# EAGLE design 119_03_INTELLIGENT_SENSOR_BOARD_816 (EAGLE 9.6.2)
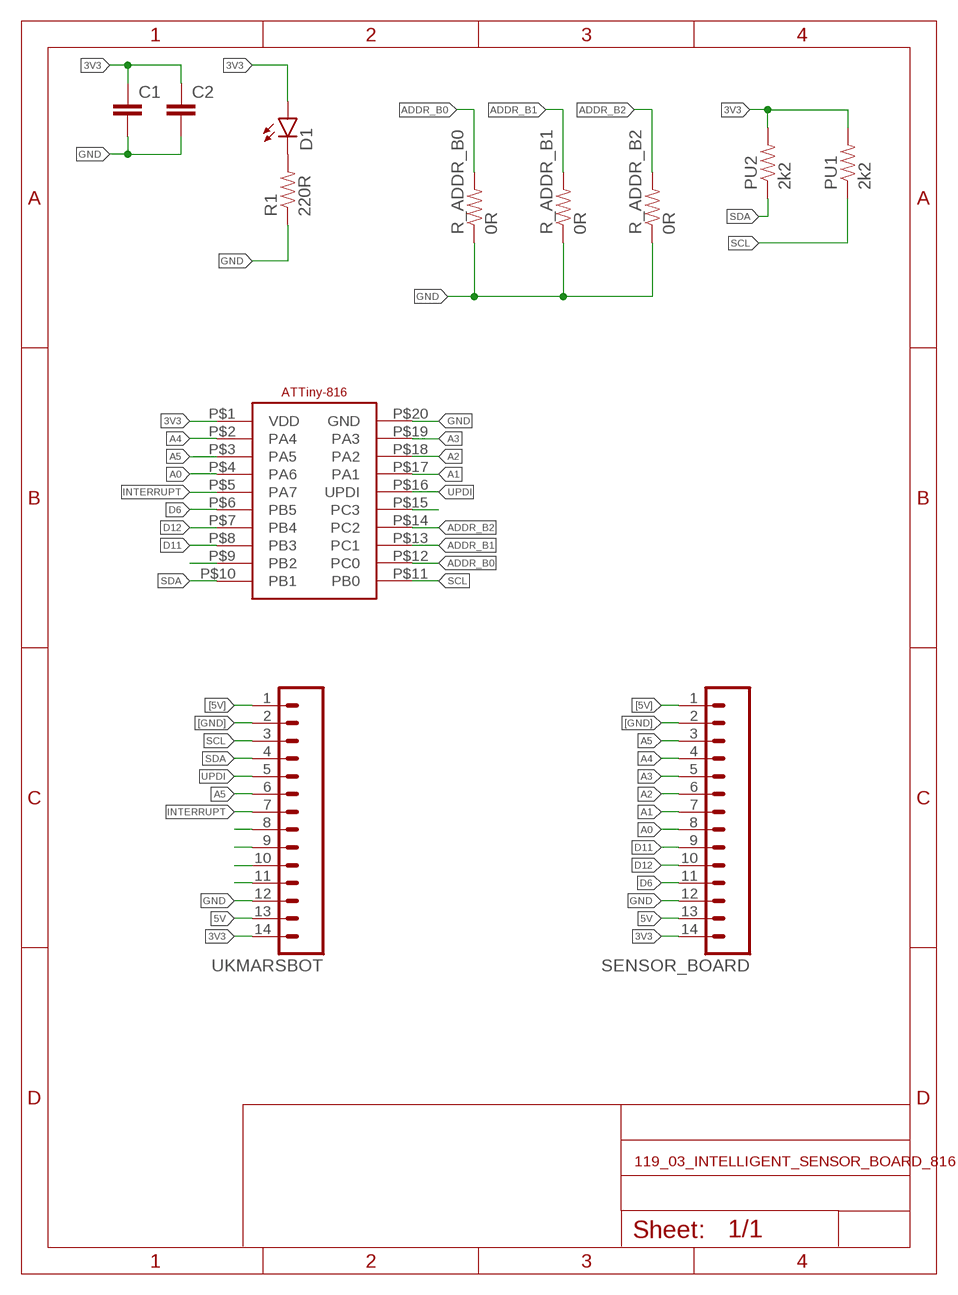
[diagram p0: schematic, sheet 1]

## Parts
C1  CAP0805  [0805]
C2  CAP0805  [0805]
D1  LEDCHIP-LED0805  [CHIP-LED0805]
PU1  2k2  RESISTOR0805-RES  [0805]
PU2  2k2  RESISTOR0805-RES  [0805]
R1  220R  RESISTOR0805-RES  [0805]
R_ADDR_B0  0R  RESISTOR0805-RES  [0805]
R_ADDR_B1  0R  RESISTOR0805-RES  [0805]
R_ADDR_B2  0R  RESISTOR0805-RES  [0805]
SENSOR_BOARD  M14  [14P]
U$2  ATTINY816  [ATTINY816_SOIC20]
UKMARSBOT  M14  [14P]

## Nets
3V3: C1.1 C2.1 D1.A PU1.2 PU2.2 SENSOR_BOARD.14 U$2.P$1(VDD) UKMARSBOT.14
5V: SENSOR_BOARD.13 UKMARSBOT.13
[5V]: SENSOR_BOARD.1 UKMARSBOT.1
[GND]: SENSOR_BOARD.2 UKMARSBOT.2
A0: SENSOR_BOARD.8 U$2.P$4(PA6)
A1: SENSOR_BOARD.7 U$2.P$17(PA1)
A2: SENSOR_BOARD.6 U$2.P$18(PA2)
A3: SENSOR_BOARD.5 U$2.P$19(PA3)
A4: SENSOR_BOARD.4 U$2.P$2(PA4)
A5: SENSOR_BOARD.3 U$2.P$3(PA5) UKMARSBOT.6
ADDR_B0: R_ADDR_B0.2 U$2.P$12(PC0)
ADDR_B1: R_ADDR_B1.2 U$2.P$13(PC1)
ADDR_B2: R_ADDR_B2.2 U$2.P$14(PC2)
D6: SENSOR_BOARD.11 U$2.P$6(PB5)
D11: SENSOR_BOARD.9 U$2.P$8(PB3)
D12: SENSOR_BOARD.10 U$2.P$7(PB4)
GND: C1.2 C2.2 R1.1 R_ADDR_B0.1 R_ADDR_B1.1 R_ADDR_B2.1 SENSOR_BOARD.12 U$2.P$20(GND) UKMARSBOT.12
INTERRUPT: U$2.P$5(PA7) UKMARSBOT.7
N$1: D1.C R1.2
N$2: U$2.P$15(PC3)
N$7: U$2.P$9(PB2)
N$9: UKMARSBOT.8
N$10: UKMARSBOT.9
N$11: UKMARSBOT.11
N$15: UKMARSBOT.10
SCL: PU1.1 U$2.P$11(PB0) UKMARSBOT.3
SDA: PU2.1 U$2.P$10(PB1) UKMARSBOT.4
UPDI: U$2.P$16(UPDI) UKMARSBOT.5

## Library data of the parts
C1 C2 = SparkFun-Capacitors:CAP: Capacitor Standard 0603 ceramic capacitor, and 0.1" leaded capacitor.
D1 = led:LED: LED OSRAM: - CHIPLED LG R971, LG N971, LY N971, LG Q971, LY Q971, LO R971, LY R971 LH N974, LH R974 LS Q976, LO Q976, LY Q976 LO Q996 - Hyper CHIPLED LW Q18S LB Q993, LB Q99A, LB R99A - SideLED LS A670, LO A670, LY A670, LG A670, LP A670 LB A673, LV A673, LT A673, LW A673 LH A674 LY A675 LS A676, LA A676, LO A676, LY A676, LW A676 LS A679, LY A679, LG A679 - Hyper Micro SIDELED® LS Y876, LA Y876, LO Y876, LY Y876 LT Y87S - SmartLED LW L88C, LW L88S LB L89C, LB L89S, LG L890 LS L89K, LO L89K, LY L89K LS L896, LA L896, LO L896, LY L896 - TOPLED LS T670, LO T670, LY T670, LG T670, LP T670 LSG T670, LSP T670, LSY T670, LOP T670, LYG T670 LG T671, LOG T671, LSG T671 LB T673, LV T673, LT T673, LW T673 LH T674 LS T676, LA T676, LO T676, LY T676, LB T676, LH T676, LSB T676, LW T676 LB T67C, LV T67C, LT T67C, LS T67K, LO T67K, LY T67K, LW E67C LS E67B, LA E67B, LO E67B, LY E67B, LB E67C, LV E67C, LT E67C LW T67C LS T679, LY T679, LG T679 LS T770, LO T770, LY T770, LG T770, LP T770 LB T773, LV T773, LT T773, LW T773 LH T774 LS E675, LA E675, LY E675, LS T675 LS T776, LA T776, LO T776, LY T776, LB T776 LHGB T686 LT T68C, LB T68C - Hyper Mini TOPLED® LB M676 - Mini TOPLED Santana® LG M470 LS M47K, LO M47K, LY M47K Source: http://www.osram.convergy.de LUXEON: - LUMILED® LXK2-PW12-R00, LXK2-PW12-S00, LXK2-PW14-U00, LXK2-PW14-V00 LXK2-PM12-R00, LXK2-PM12-S00, LXK2-PM14-U00 LXK2-PE12-Q00, LXK2-PE12-R00, LXK2-PE12-S00, LXK2-PE14-T00, LXK2-PE14-U00 LXK2-PB12-K00, LXK2-PB12-L00, LXK2-PB12-M00, LXK2-PB14-N00, LXK2-PB14-P00, LXK2-PB14-Q00 LXK2-PR12-L00, LXK2-PR12-M00, LXK2-PR14-Q00, LXK2-PR14-R00 LXK2-PD12-Q00, LXK2-PD12-R00, LXK2-PD12-S00 LXK2-PH12-R00, LXK2-PH12-S00 LXK2-PL12-P00, LXK2-PL12-Q00, LXK2-PL12-R00 Source: www.luxeon.com KINGBRIGHT: KA-3528ASYC Source: www.kingbright.com
PU1 PU2 R1 R_ADDR_B0 R_ADDR_B1 R_ADDR_B2 = SparkFun-Passives:RESISTOR: Resistor Basic schematic elements and footprints for 0603, 1206, and PTH resistors.
SENSOR_BOARD UKMARSBOT = con-amp-quick:M14: AMP QUICK CONNECTOR; OC_FARNELL: unknown; OC_NEWARK: unknown
U$2 = Stephen:ATTINY816

## Board
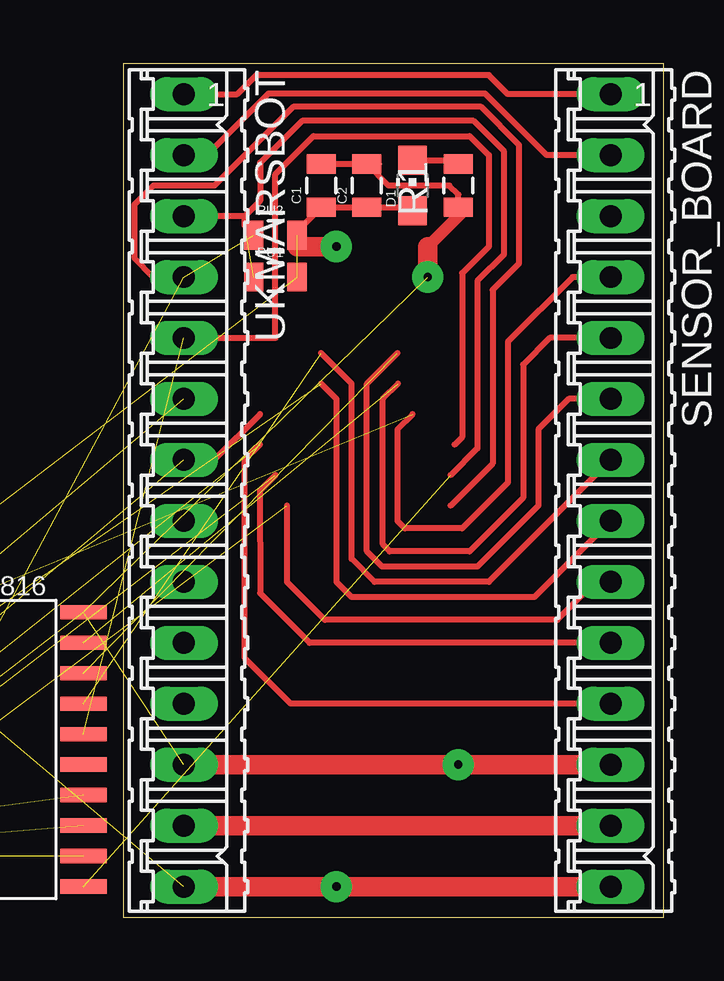
[diagram p1: board, top side]
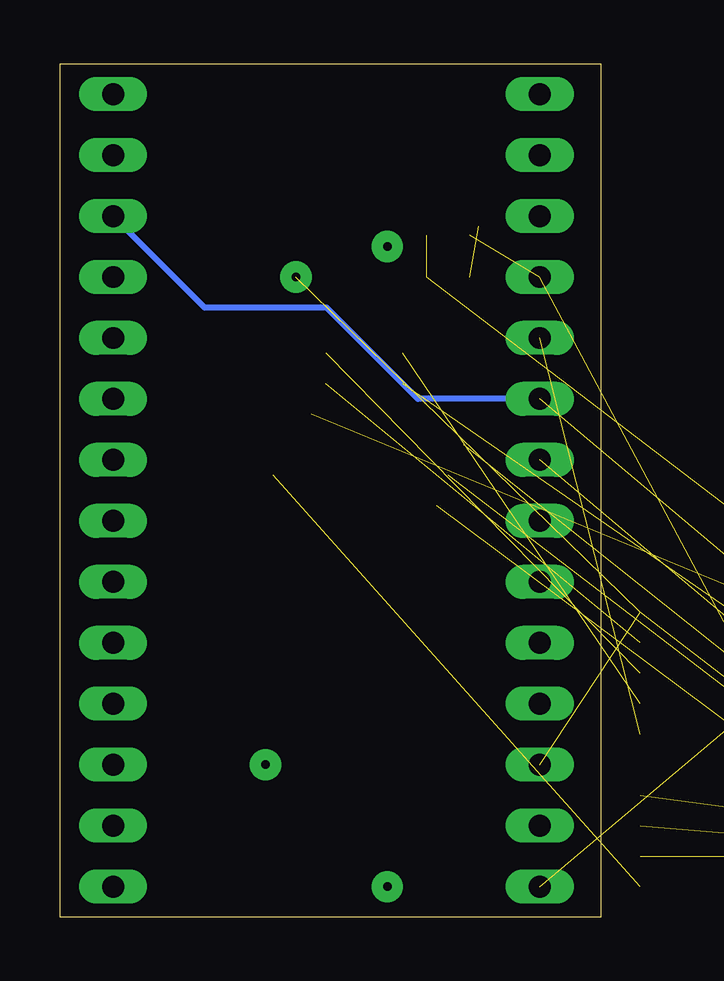
[diagram p2: board, bottom side, seen from below]

Size 22.53 x 35.55 mm. Coordinates in mm from the lower left corner, seen from the top.
Outline: 0,0 22.53,0 22.53,35.55 0,35.55 0,0
Copper layers (1*16): Top 0.035mm / dielectric 1.5mm / Bottom 0.035mm
Design rules "default": minimum track width 6mil, minimum drill 0.35mm, track to track 6mil, track to pad 6mil, pad to pad 6mil, via to via 6mil, smd to smd 6mil, copper to edge 40mil, drill to drill 6mil, minimum pad ring 10mil, minimum via ring 8mil, stop-mask expansion 4mil, vias tented up to drill 0mil, thermal gap 10mil

### Footprints (pad centres in the part's own frame; a part is rotated, then mirrored left to right if it is on the bottom)
0805 = smd 0.8 x 1.2: 1 -0.9,0; 2 0.9,0
CHIP-LED0805 = smd 1.2 x 1.2: A 0,-1.05; C 0,1.05
14P = drill 0.914 long: 1 -16.51,0; 2 -13.97,0; 3 -11.43,0; 4 -8.89,0; 5 -6.35,0; 6 -3.81,0; 7 -1.27,0; 8 1.27,0; 9 3.81,0; 10 6.35,0; 11 8.89,0; 12 11.43,0; 13 13.97,0; 14 16.51,0
ATTINY816_SOIC20 = smd 1.95 x 0.6: P$1 -4.7,5.08; P$2 -4.7,3.81; P$3 -4.7,2.54; P$4 -4.7,1.27; P$5 -4.7,0; P$6 -4.7,-1.27; P$7 -4.7,-2.54; P$8 -4.7,-3.81; P$9 -4.7,-5.08; P$10 -4.7,-6.35; P$11 4.7,-6.35; P$12 4.7,-5.08; P$13 4.7,-3.81; P$14 4.7,-2.54; P$15 4.7,-1.27; P$16 4.7,0; P$17 4.7,1.27; P$18 4.7,2.54; P$19 4.7,3.81; P$20 4.7,5.08

### Placement (x,y rotation side)
C1  8.26,30.48 90 top
C2  10.16,30.48 90 top
D1  12.06,30.48 0 top
PU1  6.35,26.67 0 top
PU2  6.35,28.42 0 top
R1  13.97,30.48 90 top
R_ADDR_B0  -13.97,2.54 0 top  (outside the outline)
R_ADDR_B1  -17.78,2.54 0 top  (outside the outline)
R_ADDR_B2  -21.59,2.54 0 top  (outside the outline)
SENSOR_BOARD  20.32,17.78 270 top
U$2  -6.35,7.62 0 top
UKMARSBOT  2.54,17.78 270 top

### Tracks (layer width: path | path; a pad name or v marks a point on that pad's centre or on a via)
3V3  (via drill 0.35 pad 1.3)  (3 unrouted)
  Top 0.254: D1.A 12.04,29.58 C2.1 C1.1 7.25,28.57 PU2.2 7.25,27.94
  Top 0.813: SENSOR_BOARD.14 v8.89,1.27 UKMARSBOT.14 | v8.89,27.94 7.25,27.94
5V
  Top 0.813: UKMARSBOT.13 SENSOR_BOARD.13
[5V]
  Top 0.254: SENSOR_BOARD.1 16.03,34.29 15.24,35.08 5.56,35.08 4.76,34.29 UKMARSBOT.1
[GND]
  Top 0.254: SENSOR_BOARD.2 17.65,31.75 15.08,34.32 6.06,34.32 3.49,31.75 UKMARSBOT.2
A0  (1 unrouted)
  Top 0.254: 8.26,22.23 8.89,21.59 8.89,13.97 9.53,13.34 17.14,13.34 SENSOR_BOARD.8
A1  (1 unrouted)
  Top 0.254: SENSOR_BOARD.7 15.24,13.97 10.48,13.97 9.53,14.92 9.53,22.23 8.26,23.5
A2  (1 unrouted)
  Top 0.254: SENSOR_BOARD.6 18.57,21.59 17.3,20.32 17.3,17.14 14.76,14.61 10.79,14.61 10.16,15.24 10.16,22.23 11.43,23.5
A3  (1 unrouted)
  Top 0.254: SENSOR_BOARD.5 17.78,24.13 16.67,23.02 16.67,17.46 14.45,15.24 11.11,15.24 10.83,15.53 10.83,21.59 11.46,22.23
A4  (1 unrouted)
  Top 0.254: 12.06,20.95 11.43,20.32 11.43,16.51 11.75,16.19 14.12,16.19 16.03,18.1 16.03,23.97 18.73,26.67 SENSOR_BOARD.4
A5  (1 unrouted)
  Bottom 0.254: UKMARSBOT.6 7.62,21.59 11.43,25.4 16.51,25.4 SENSOR_BOARD.3
ADDR_B0  (1 unrouted)
ADDR_B1  (1 unrouted)
ADDR_B2  (1 unrouted)
D6  (1 unrouted)
  Top 0.254: SENSOR_BOARD.11 6.99,8.89 5.08,10.79 5.08,19.05 5.71,19.68
D11  (1 unrouted)
  Top 0.254: 20.95,13.97 SENSOR_BOARD.9 19.68,13.97 18.1,12.38 8.41,12.38 6.83,13.97 6.83,17.14
D12  (1 unrouted)
  Top 0.254: SENSOR_BOARD.10 7.78,11.43 5.71,13.49 5.71,17.77 6.35,18.41
GND  (via drill 0.35 pad 1.3)  (5 unrouted)
  Top 0.254: 21.59,6.35 SENSOR_BOARD.12 | C1.2 C2.2 | 10.67,31.38 C2.2 | 14.13,29.37 R1.1 13.97,30.11 13.6,30.48 11.06,30.48 C2.2
  Top 0.508: 12.7,27.94 14.13,29.37
  Top 0.813: SENSOR_BOARD.12 v13.97,6.35 UKMARSBOT.12 | 12.86,26.67 v12.7,26.67 12.7,27.94
INTERRUPT  (1 unrouted)
  Top 0.254: UKMARSBOT.7 3.81,19.05 5.71,20.95
N$1
  Top 0.254: R1.2 13.87,31.53 D1.C
SCL  (2 unrouted)
  Top 0.254: 5.08,29.21 UKMARSBOT.3 | 13.65,18.41 14.77,19.53 14.77,26.51 15.88,27.62 15.88,31.91 14.61,33.18 7.46,33.18 5.71,31.43 5.71,29.84 5.08,29.21 | 5.08,28.79 5.08,29.21
SDA  (2 unrouted)
  Top 0.254: 13.65,17.14 15.4,18.89 15.4,26.14 16.51,27.25 16.51,32.17 14.92,33.76 7.09,33.76 3.81,30.48 1.27,30.48 0.48,29.69 0.48,27.46 1.27,26.67 UKMARSBOT.4
UPDI  (1 unrouted)
  Top 0.254: UKMARSBOT.5 6.35,24.13 6.35,30.96 7.93,32.54 14.45,32.54 15.24,31.75 15.24,27.94 14.13,26.83 14.13,20 13.81,19.68